# EAGLE design LCD Board v1.3 (EAGLE 6.5.0)

## Sheet 1 of 2
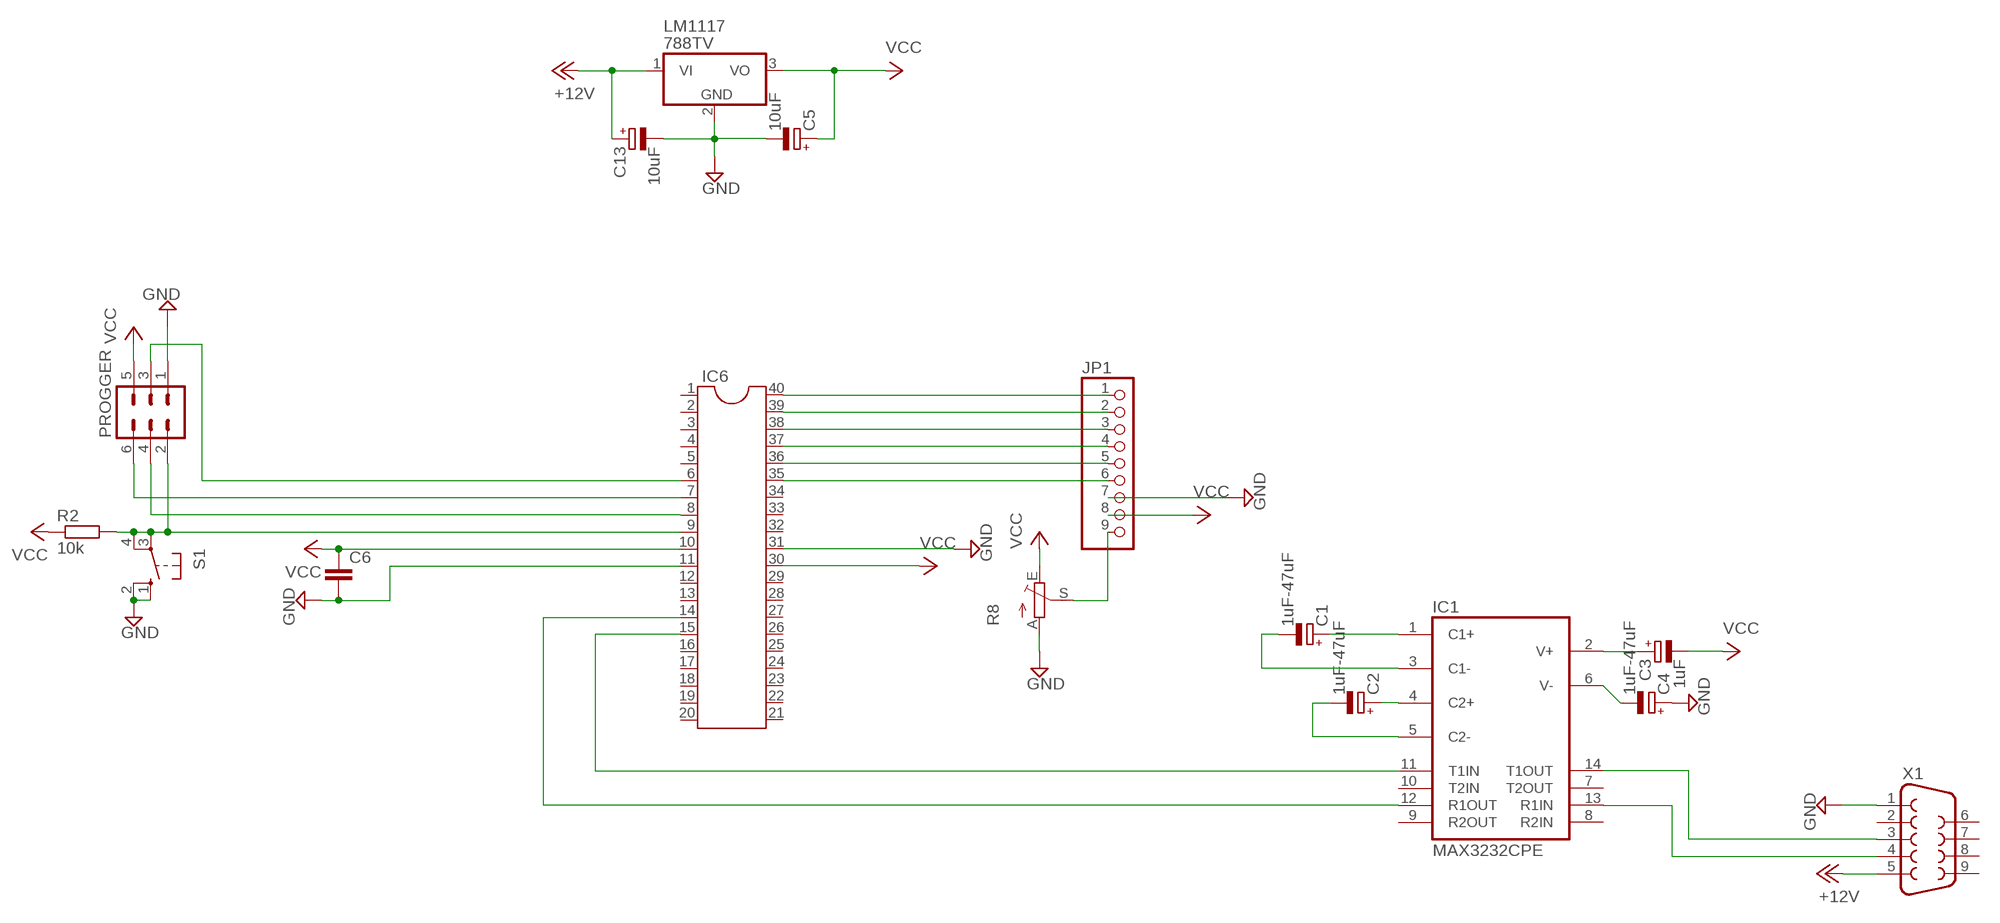
[diagram p0: schematic, sheet 1]

### Parts
C1  1uF-47uF  CPOL-EUTT5D7  [TT5D7]
C2  1uF-47uF  CPOL-EUE2.5-4V  [E2,5RE]
C3  1uF  CPOL-EUTT5D7  [TT5D7]
C4  1uF-47uF  CPOL-EUE2.5-4V  [E2,5RE]
C5  10uF  CPOL-EUE3.5-8  [E3,5-8]
C6  C-EU025-030X050  [C025-030X050]
C13  10uF  CPOL-EUE2.5-4V  [E2,5RE]
IC1  MAX3232CPE  [DIL16]
IC6  DIL40  [DIL40]
JP1  PINHD-1X9  [1X09]
LM1117  788TV  [TO220V]
PROGGER  MA03-2  [MA03-2]
R2  10k  R-EU_0207/7  [0207/7]
R8  TRIM_EU-CA6V  [CA6V]
S1  10-XX  [B3F-10XX]
X1  F09H  [F09H]

### Nets
$N4: C4.+ C5.- C6.2 C13.- IC6.11 IC6.31 JP1.7 LM1117.2(GND) PROGGER.1 R8.A S1.1(S) S1.2(S1) X1.1 ; supply symbol labelled GND ; also sheet 2
+12V: C13.+ LM1117.1(VI) X1.5 ; also sheet 2
N$1: IC6.7 PROGGER.6
N$2: IC6.8 PROGGER.4
N$3: IC6.9 PROGGER.2 R2.2 S1.3(P) S1.4(P1)
N$4: IC6.6 PROGGER.3
N$5: C1.+ IC1.1(C1+)
N$6: C1.- IC1.3(C1-)
N$7: C2.+ IC1.4(C2+)
N$8: C2.- IC1.5(C2-)
N$9: C3.+ IC1.2(V+)
N$10: C4.- IC1.6(V-)
N$11: IC1.11(T1IN) IC6.15
N$12: IC1.12(R1OUT) IC6.14
N$13: IC1.13(R1IN) X1.4
N$14: IC1.14(T1OUT) X1.3
N$15: IC6.40 JP1.1
N$16: IC6.39 JP1.2
N$17: IC6.38 JP1.3
N$18: IC6.37 JP1.4
N$19: IC6.36 JP1.5
N$20: IC6.35 JP1.6
N$21: JP1.9 R8.S
VCC: C3.- C5.+ C6.1 IC6.10 IC6.30 JP1.8 LM1117.3(VO) PROGGER.5 R2.1 R8.E ; also sheet 2
Unconnected: IC1.7(T2OUT) IC1.8(R2IN) IC1.9(R2OUT) IC1.10(T2IN) IC6.1 IC6.2 IC6.3 IC6.4 IC6.5 IC6.12 IC6.13 IC6.16 IC6.17 IC6.18 IC6.19 IC6.20 IC6.21 IC6.22 IC6.23 IC6.24 IC6.25 IC6.26 IC6.27 IC6.28 IC6.29 IC6.32 IC6.33 IC6.34 X1.2 X1.6 X1.7 X1.8 X1.9

## Sheet 2 of 2
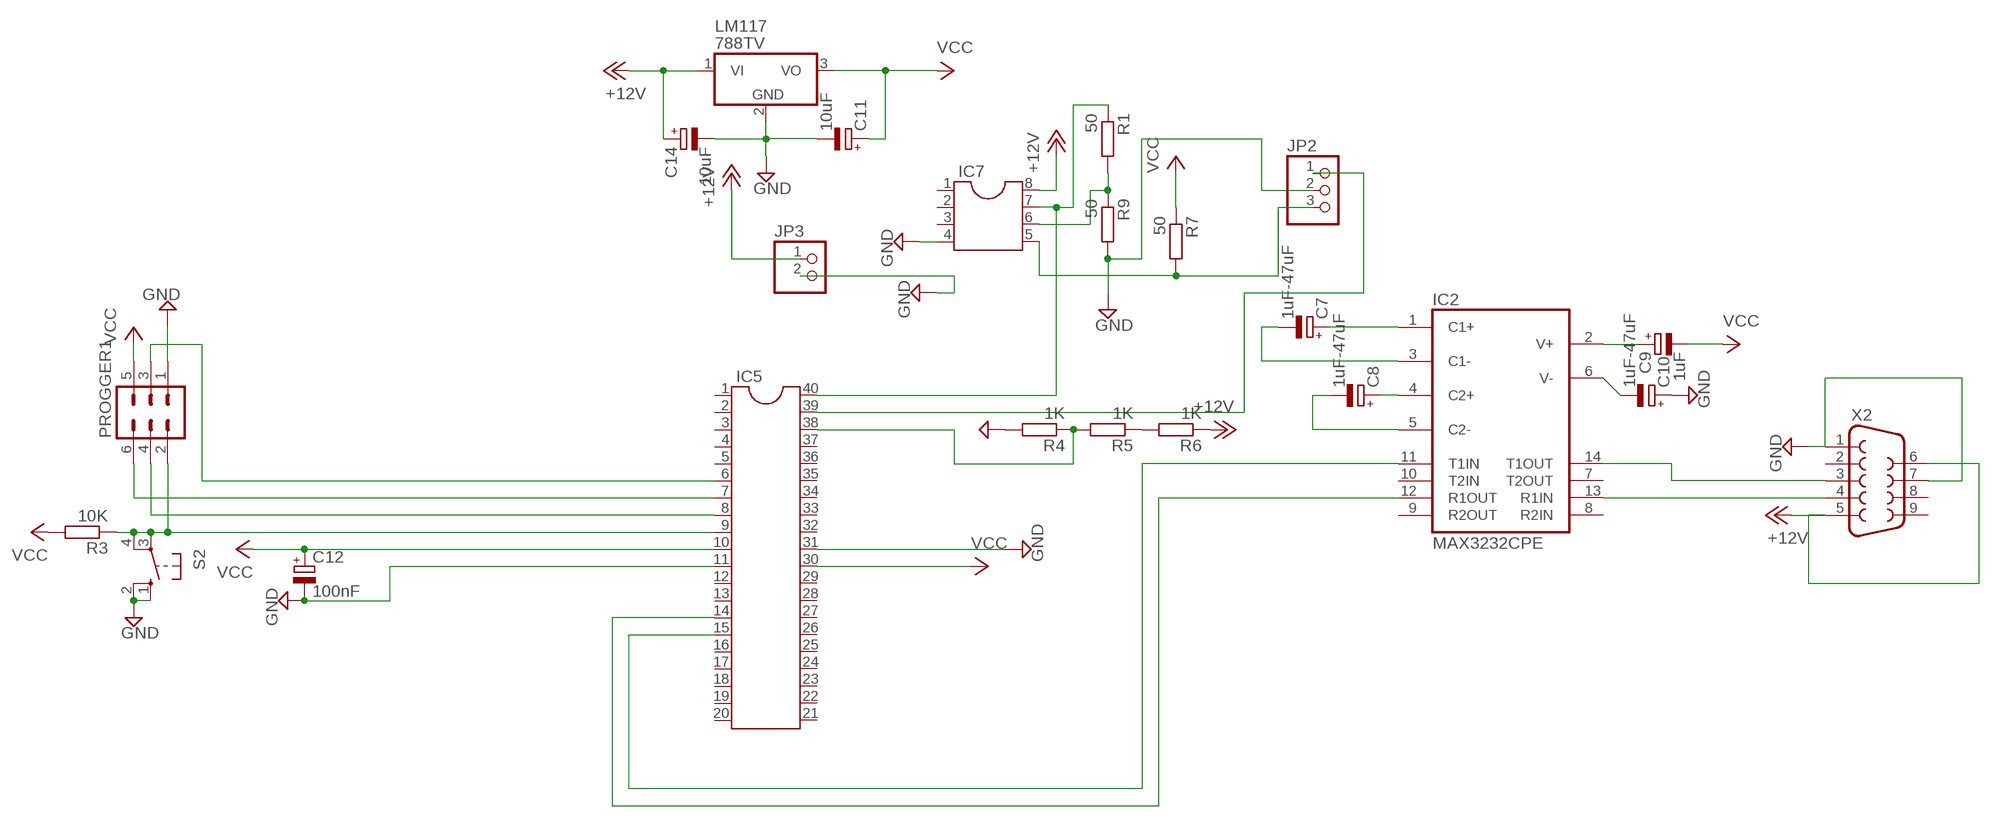
[diagram p1: schematic, sheet 2]

### Parts
C7  1uF-47uF  CPOL-EUTT5D7  [TT5D7]
C8  1uF-47uF  CPOL-EUE2.5-4V  [E2,5RE]
C9  1uF  CPOL-EUTT5D7  [TT5D7]
C10  1uF-47uF  CPOL-EUE2.5-4V  [E2,5RE]
C11  10uF  CPOL-EUE2.5-4V  [E2,5RE]
C12  100nF  CPOL-EUE2.5-4V  [E2,5RE]
C14  10uF  CPOL-EUE2.5-4V  [E2,5RE]
IC2  MAX3232CPE  [DIL16]
IC5  DIL40  [DIL40]
IC7  DIL8  [DIL08]
JP2  PINHD-1X3  [1X03]
JP3  PINHD-1X2  [1X02]
LM117  788TV  [TO220V]
PROGGER1  MA03-2  [MA03-2]
R1  50  R-EU_0204/7  [0204/7]
R3  10K  R-EU_0207/7  [0207/7]
R4  1K  R-EU_0204/7  [0204/7]
R5  1K  R-EU_0204/7  [0204/7]
R6  1K  R-EU_0204/7  [0204/7]
R7  50  R-EU_0204/5  [0204/5]
R9  50  R-EU_0204/7  [0204/7]
S2  10-XX  [B3F-10XX]
X2  F09H  [F09H]

### Nets
$N4: C10.+ C11.- C12.- C14.- IC5.11 IC5.31 IC7.4 JP2.2 JP3.2 LM117.2(GND) PROGGER1.1 R4.2 R9.2 S2.1(S) S2.2(S1) X2.1 X2.7 ; supply symbol labelled GND ; also sheet 1
+12V: C14.+ IC7.8 JP3.1 LM117.1(VI) R6.1 X2.5 X2.6 ; also sheet 1
N$22: IC5.8 PROGGER1.4
N$23: IC5.9 PROGGER1.2 R3.1 S2.3(P) S2.4(P1)
N$24: IC5.6 PROGGER1.3
N$25: C7.- IC2.3(C1-)
N$26: C8.+ IC2.4(C2+)
N$27: C8.- IC2.5(C2-)
N$28: C9.+ IC2.2(V+)
N$29: C10.- IC2.6(V-)
N$30: IC2.13(R1IN) X2.4
N$31: IC2.14(T1OUT) X2.3
N$32: IC2.11(T1IN) IC5.15
N$33: IC2.12(R1OUT) IC5.14
N$34: C7.+ IC2.1(C1+)
N$35: IC5.7 PROGGER1.6
N$36: IC5.38 R4.1 R5.2
N$37: R5.1 R6.2
N$38: IC5.40 IC7.7 R1.1
N$39: IC5.39 JP2.1
N$42: IC7.5 JP2.3 R7.2
N$44: IC7.6 R1.2 R9.1
VCC: C9.- C11.+ C12.+ IC5.10 IC5.30 LM117.3(VO) PROGGER1.5 R3.2 R7.1 ; also sheet 1
Unconnected: IC2.7(T2OUT) IC2.8(R2IN) IC2.9(R2OUT) IC2.10(T2IN) IC5.1 IC5.2 IC5.3 IC5.4 IC5.5 IC5.12 IC5.13 IC5.16 IC5.17 IC5.18 IC5.19 IC5.20 IC5.21 IC5.22 IC5.23 IC5.24 IC5.25 IC5.26 IC5.27 IC5.28 IC5.29 IC5.32 IC5.33 IC5.34 IC5.35 IC5.36 IC5.37 IC7.1 IC7.2 IC7.3 X2.2 X2.8 X2.9

## Power pins joined to a net without a drawn wire
$N4: IC1.15(GND) IC2.15(GND)
VCC: IC1.16(VCC) IC2.16(VCC)

## Library data of the parts
C1-C5 C7-C14 = rcl:CPOL-EU: POLARIZED CAPACITOR, European symbol
C6 = rcl:C-EU: CAPACITOR, European symbol
IC1 IC2 = maxim:MAX3232*: True RS-232 Transceivers 3.0V to 5.5V, Low-Power up to 1Mbps, Using Four 0.1µF External Capacitors Source: http://pdfserv.maxim-ic.com/en/ds/MAX3222-MAX3241.pdf; MF: MAXIM; MPN: MAX3232CPE+; OC_FARNELL: 9724494; OC_NEWARK: 68K4626
IC5 IC6 = ic-package:DIL40: Dual In Line
IC7 = ic-package:DIL8: Dual In Line / Socket
JP1 = pinhead:PINHD-1X9: PIN HEADER
JP2 = pinhead:PINHD-1X3: PIN HEADER
JP3 = pinhead:PINHD-1X2: PIN HEADER
LM117 LM1117 = linear:78*: Positive VOLTAGE REGULATOR Source: http://cache.national.com/ds/LM/LM78L05.pdf http://www.fairchildsemi.com/ds/LM/LM7805.pdf
PROGGER PROGGER1 = con-lstb:MA03-2: PIN HEADER; OC_FARNELL: unknown; OC_NEWARK: unknown
R1-R3 R9 = rcl:R-EU_: RESISTOR, European symbol
R4-R7 = resistor:R-EU_: RESISTOR, European symbol
R8 = pot:TRIM_EU-: POTENTIOMETER
S1 S2 = switch-omron:10-XX: OMRON SWITCH; MPN: B3F-1000; OC_FARNELL: 176432; OC_NEWARK: 36M3542
X1 X2 = con-subd:F09: SUB-D; OC_FARNELL: unknown; OC_NEWARK: unknown

## Board
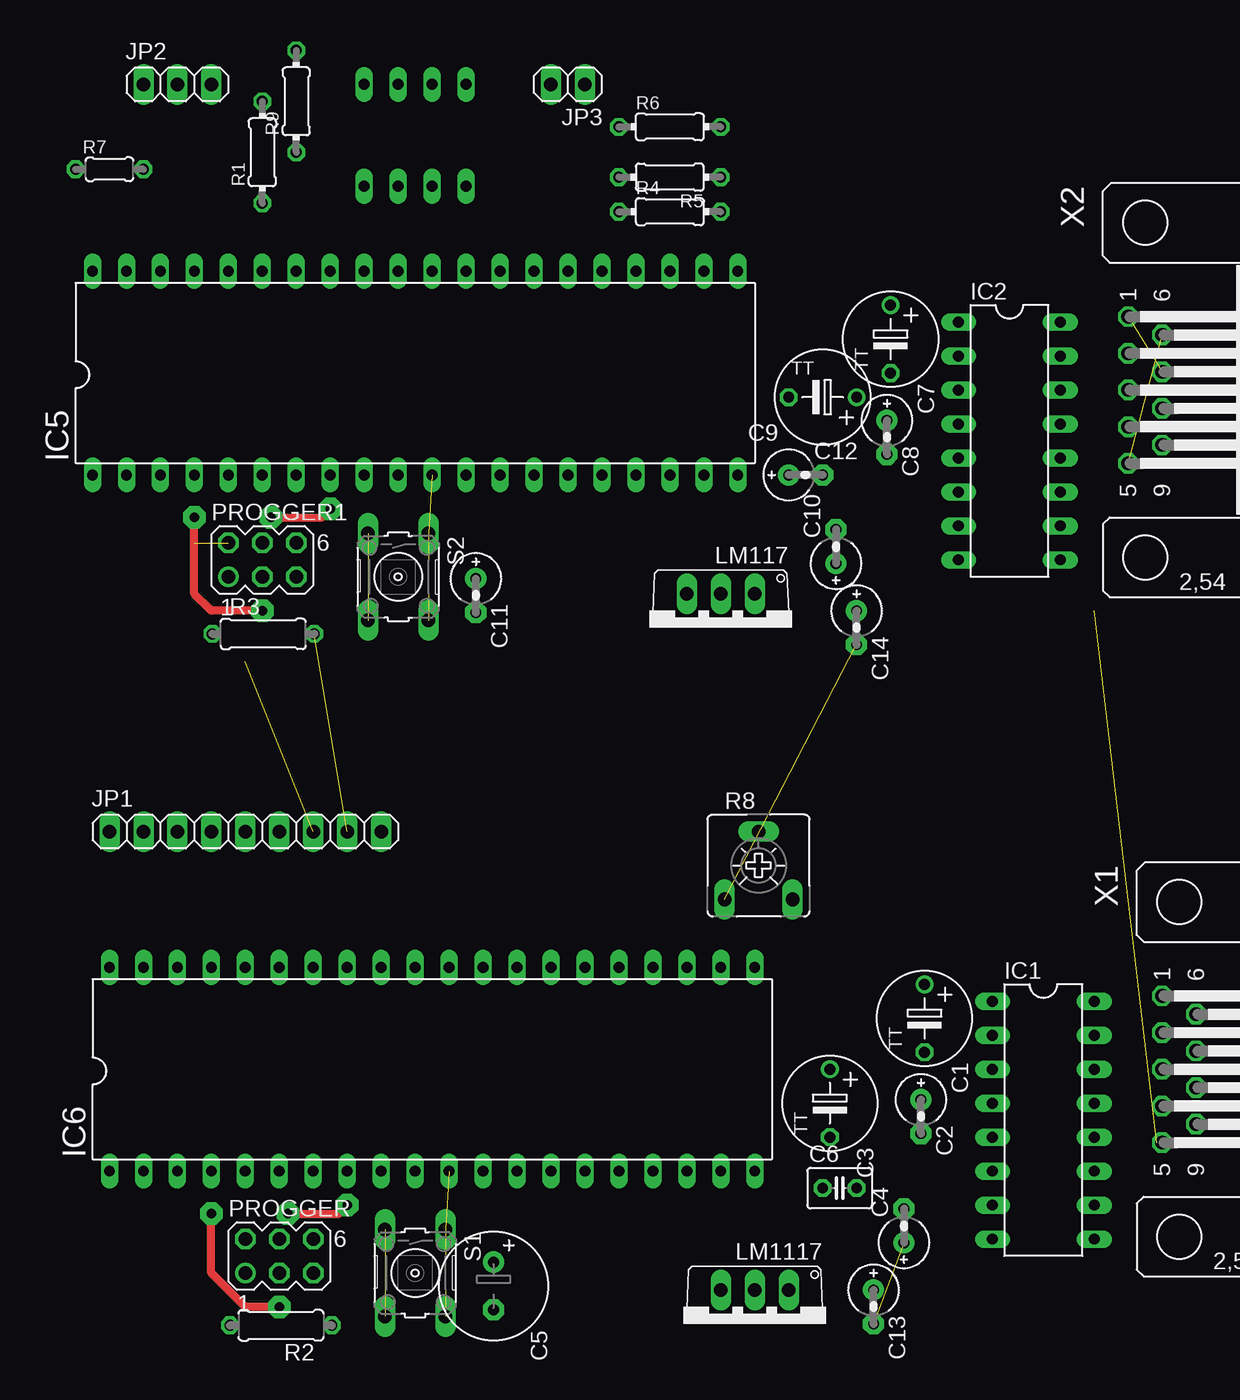
[diagram p2: board, top side]
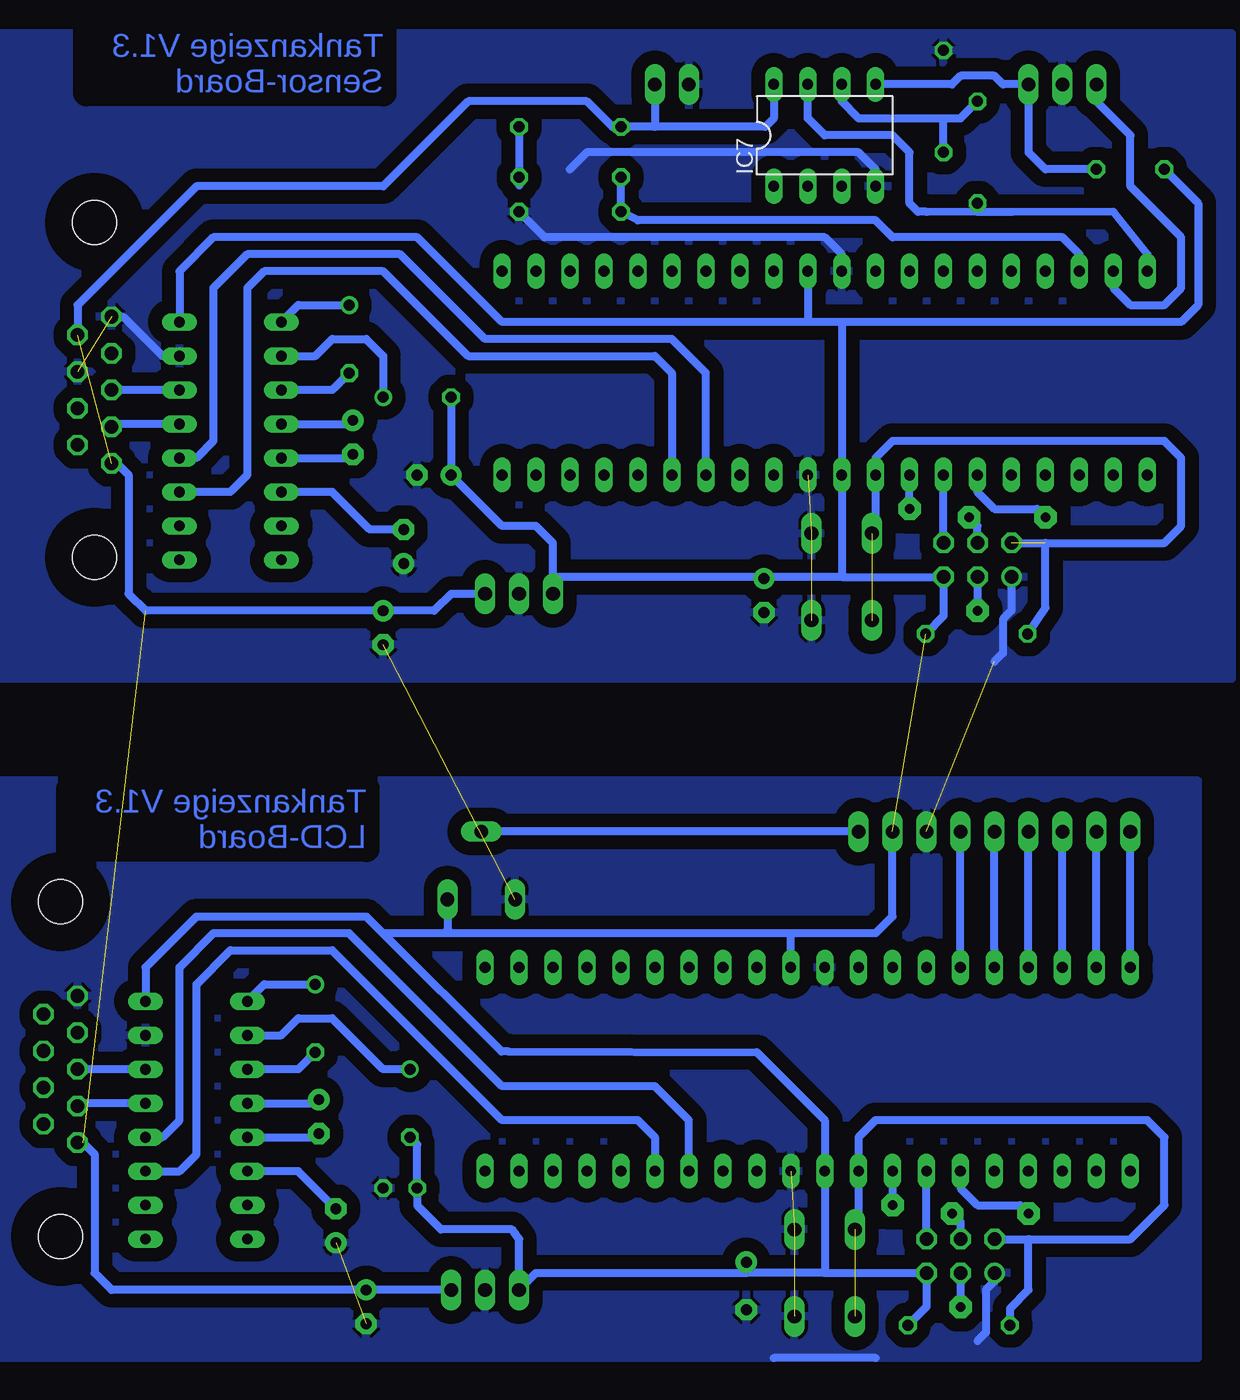
[diagram p3: board, bottom side, seen from below]

No outline drawn. Coordinates in mm, seen from the top.
Copper layers (1*16): Top 0.035mm / dielectric 1.5mm / Bottom 0.035mm
Design rules "default *": minimum track width 10mil, minimum drill 24mil, track to track 8mil, track to pad 8mil, pad to pad 8mil, via to via 8mil, smd to smd 8mil, copper to edge 40mil, drill to drill 8mil, minimum pad ring 10mil, minimum via ring 8mil, stop-mask expansion 4mil, vias tented up to drill 0mil, thermal gap 10mil

### Footprints (pad centres in the part's own frame; a part is rotated, then mirrored left to right if it is on the bottom)
TT5D7 = drill 0.813: + -2.54,0 | drill 0.813 octagon: - 2.54,0
E2,5RE = drill 0.813 pad 1.575: + -1.27,0 | drill 0.813 pad 1.575 octagon: - 1.27,0
E3,5-8 = drill 0.813 pad 1.6: + -1.778,0 | drill 0.813 pad 1.6 octagon: - 1.778,0
C025-030X050 = drill 0.813 octagon: 1 -1.27,0; 2 1.27,0
DIL16 = drill 0.813 long: 1 -8.89,-3.81; 2 -6.35,-3.81; 3 -3.81,-3.81; 4 -1.27,-3.81; 5 1.27,-3.81; 6 3.81,-3.81; 7 6.35,-3.81; 8 8.89,-3.81; 9 8.89,3.81; 10 6.35,3.81; 11 3.81,3.81; 12 1.27,3.81; 13 -1.27,3.81; 14 -3.81,3.81; 15 -6.35,3.81; 16 -8.89,3.81
DIL40 = drill 0.813 long: 1 -24.13,-7.62; 2 -21.59,-7.62; 3 -19.05,-7.62; 4 -16.51,-7.62; 5 -13.97,-7.62; 6 -11.43,-7.62; 7 -8.89,-7.62; 8 -6.35,-7.62; 9 -3.81,-7.62; 10 -1.27,-7.62; 11 1.27,-7.62; 12 3.81,-7.62; 13 6.35,-7.62; 14 8.89,-7.62; 15 11.43,-7.62; 16 13.97,-7.62; 17 16.51,-7.62; 18 19.05,-7.62; 19 21.59,-7.62; 20 24.13,-7.62; 21 24.13,7.62; 22 21.59,7.62; 23 19.05,7.62; 24 16.51,7.62; 25 13.97,7.62; 26 11.43,7.62; 27 8.89,7.62; 28 6.35,7.62; 29 3.81,7.62; 30 1.27,7.62; 31 -1.27,7.62; 32 -3.81,7.62; 33 -6.35,7.62; 34 -8.89,7.62; 35 -11.43,7.62; 36 -13.97,7.62; 37 -16.51,7.62; 38 -19.05,7.62; 39 -21.59,7.62; 40 -24.13,7.62
DIL08 = drill 0.813 long: 1 -3.81,-3.81; 2 -1.27,-3.81; 3 1.27,-3.81; 4 3.81,-3.81; 5 3.81,3.81; 6 1.27,3.81; 7 -1.27,3.81; 8 -3.81,3.81
1X09 = drill 1.016 long: 1 -10.16,0; 2 -7.62,0; 3 -5.08,0; 4 -2.54,0; 5 0,0; 6 2.54,0; 7 5.08,0; 8 7.62,0; 9 10.16,0
1X03 = drill 1.016 long: 1 -2.54,0; 2 0,0; 3 2.54,0
1X02 = drill 1.016 long: 1 -1.27,0; 2 1.27,0
TO220V = drill 1.016 long: 1 -2.54,-2.54; 2 0,-2.54; 3 2.54,-2.54
MA03-2 = drill 1.016: 1 -2.54,-1.27 | drill 1.016 octagon: 2 -2.54,1.27; 3 0,-1.27; 4 0,1.27; 5 2.54,-1.27; 6 2.54,1.27
0204/7 = drill 0.813 octagon: 1 -3.81,0; 2 3.81,0
0207/7 = drill 0.813 octagon: 1 -3.81,0; 2 3.81,0
0204/5 = drill 0.813 octagon: 1 -2.54,0; 2 2.54,0
CA6V = drill 1.016 long: A -2.54,-2.54; E 2.54,-2.54; S 0,2.54
B3F-10XX = drill 1.016 long: 1 -3.251,2.261; 2 3.251,2.261; 3 -3.251,-2.261; 4 3.251,-2.261
F09H = drill 1.016 octagon: 1 -5.486,-1.27; 2 -2.743,-1.27; 3 0,-1.27; 4 2.743,-1.27; 5 5.486,-1.27; 6 -4.115,1.27; 7 -1.372,1.27; 8 1.372,1.27; 9 4.115,1.27 | hole 3.302: -12.522,0; 12.522,0

### Placement (x,y rotation side)
C1  77.47,26.67 270 top
C2  77.2,19.32 270 top
C3  70.39,20.32 270 top
C4  75.93,11.16 90 top
C5  45.23,6.65 270 top
C6  71.12,13.97 0 top
C7  74.93,77.47 270 top
C8  74.66,70.12 270 top
C9  69.85,73.12 180 top
C10  70.85,61.96 90 top
C11  43.91,58.28 270 top
C12  68.58,67.31 0 top
C13  73.66,5.08 270 top
C14  72.39,55.88 270 top
IC1  86.36,19.05 270 top
IC2  83.82,69.85 270 top
IC5  39.37,74.93 0 top
IC6  40.64,22.86 0 top
IC7  39.37,92.71 0 bottom
JP1  26.67,40.64 0 top
JP2  21.59,96.52 0 top
JP3  50.8,96.52 180 top
LM117  62.23,55.88 180 top
LM1117  64.77,3.81 180 top
PROGGER  29.21,8.89 0 top
PROGGER1  27.94,60.96 0 top
R1  27.94,91.44 90 top
R2  29.33,3.71 180 top
R3  28.01,55.42 0 top
R4  58.42,87 0 top
R5  58.41,89.58 180 top
R6  58.42,93.34 0 top
R7  16.51,90.17 0 top
R8  65.05,38.1 0 top
R9  30.48,95.25 90 top
S1  39.37,7.62 270 top
S2  38.1,59.69 270 top
X1  96.52,22.86 270 top
X2  93.98,73.66 270 top

### Tracks (layer width: path | path; a pad name or v marks a point on that pad's centre or on a via)
$N4  (8 unrouted)
  Bottom 0.61: IC7.4 35.56,90.17 36.83,91.44 57.15,91.44 58.42,90.17 | X2.1 91.85,79.15 88.9,76.2 IC2.15 | IC5.31 38.1,83.82 39.37,85.09 60.33,85.09 R4.2 | PROGGER.1 26.67,6.99 27.3,6.35 27.3,3.17 27.94,2.54 | 35.56,1.27 43.18,1.27 | PROGGER1.1 25.4,57.15 26.04,56.52 26.04,53.98 26.67,53.34
  pour Bottom (isolate 1.016): 106.68,1.27 11.43,1.27 11.43,44.45 106.68,44.45
  pour Bottom (isolate 1.016): 104.14,52.07 8.89,52.07 8.89,100.33 104.14,100.33
+12V  (2 unrouted)
  Bottom 0.61: LM117.1 67.31,58.42 68.58,57.15 C14.+ 90.17,57.15 91.44,58.42 91.44,67.31 92.3,68.17 X2.5 | IC7.8 43.18,93.98 43.81,93.34 52.07,93.34 | 52.07,93.34 R6.1 55.24,93.34 57.15,95.25 66.04,95.25 72.39,88.9 86.36,88.9 95.25,80.01 X2.6 | JP3.1 52.07,93.34 | LM1117.1 C13.+ 92.71,6.35 93.98,7.62 93.98,16.51 94.84,17.37 X1.5
N$1
  Bottom 0.61: PROGGER.6 IC6.7
N$2  (via drill 0.7 pad 1.68)
  Top 0.61: v29.84,12.06 33.66,12.06 v34.29,12.7
  Bottom 0.61: IC6.8 v34.29,12.7 | v29.84,12.06 29.21,11.43 PROGGER.4
N$3  (1 unrouted)
  Bottom 0.61: PROGGER.2 24.13,10.16 | 24.13,10.16 16.51,10.16 13.97,12.7 13.97,17.78 15.24,19.05 35.56,19.05 36.83,17.78 IC6.9 | 36.83,16.51 IC6.9 | R2.2 25.5,4.98 24.13,6.35 24.13,10.16 | IC6.9 36.83,11.15 S1.3
N$4  (via drill 0.7 pad 1.68)
  Top 0.61: v29.21,5.08 26.67,5.08 24.13,7.62 v24.13,12.06
  Bottom 0.61: PROGGER.3 v29.21,5.08 | IC6.6 29.21,13.97 27.94,12.7 24.77,12.7 v24.13,12.06
N$5
  Bottom 0.61: IC1.1 81.28,29.21 C1.+
N$6
  Bottom 0.61: C1.- 78.74,22.86 IC1.3
N$7
  Bottom 0.61: IC1.4 77.22,20.32 C2.+
N$8
  Bottom 0.61: IC1.5 77.72,17.78 C2.-
N$9
  Bottom 0.61: IC1.2 80.01,25.4 78.74,26.67 76.2,26.67 72.39,22.86 C3.+
N$10
  Bottom 0.61: C4.- 75.68,12.18 78.74,15.24 IC1.6
N$11
  Bottom 0.61: IC6.15 52.07,17.78 53.34,19.05 63.5,19.05 76.2,31.75 83.82,31.75 86.36,29.21 86.36,16.51 87.63,15.24 IC1.11
N$12
  Bottom 0.61: IC1.12 88.9,17.78 87.63,19.05 87.63,30.48 85.09,33.02 74.93,33.02 63.5,21.59 52.07,21.59 49.53,19.05 IC6.14
N$13
  Bottom 0.61: IC1.13 95.05,20.32 X1.4
N$14
  Bottom 0.61: IC1.14 X1.3
N$15
  Bottom 0.61: IC6.40 JP1.1
N$16
  Bottom 0.61: IC6.39 JP1.2
N$17
  Bottom 0.61: IC6.38 JP1.3
N$18
  Bottom 0.61: IC6.37 JP1.4
N$19
  Bottom 0.61: 26.67,31.75 IC6.36 JP1.5
N$20
  Bottom 0.61: IC6.35 JP1.6
N$21
  Bottom 0.61: JP1.9 R8.S
N$22  (via drill 0.7 pad 1.68)
  Top 0.61: v28.57,64.14 32.38,64.14 v33.02,64.77
  Bottom 0.61: PROGGER1.4 27.94,63.5 v28.57,64.14 | v33.02,64.77 IC5.8
N$23  (2 unrouted)
  Bottom 0.61: S2.3 35.56,63.22 IC5.9 35.56,68.58 34.29,69.85 13.97,69.85 12.7,68.58 12.7,63.5 13.97,62.23 PROGGER1.2 | 22.86,62.23 22.86,57.39 R3.1
N$24  (via drill 0.7 pad 1.68)
  Top 0.61: v27.94,57.15 24.13,57.15 22.86,58.42 v22.86,64.14
  Bottom 0.61: IC5.6 27.94,66.04 26.67,64.77 23.5,64.77 v22.86,64.14 | PROGGER1.3 v27.94,57.15
N$25
  Bottom 0.61: C7.- 76.2,73.66 IC2.3
N$26
  Bottom 0.61: IC2.4 74.68,71.12 C8.+
N$27
  Bottom 0.61: IC2.5 75.18,68.58 C8.-
N$28
  Bottom 0.61: IC2.2 77.47,76.2 76.2,77.47 73.66,77.47 72.39,76.2 C9.+
N$29
  Bottom 0.61: IC2.6 76.2,66.04 73.39,63.23 C10.-
N$30
  Bottom 0.61: IC2.13 92.51,71.12 X2.4
N$31
  Bottom 0.61: IC2.14 X2.3
N$32
  Bottom 0.61: IC2.11 83.82,66.04 82.55,67.31 82.55,81.28 81.28,82.55 72.39,82.55 66.04,76.2 52.07,76.2 50.8,74.93 IC5.15
N$33
  Bottom 0.61: IC5.14 48.26,74.93 50.8,77.47 64.77,77.47 71.12,83.82 82.55,83.82 85.09,81.28 85.09,69.85 86.36,68.58 IC2.12
N$34
  Bottom 0.61: IC2.1 78.74,80.01 C7.+
N$35
  Bottom 0.61: PROGGER1.6 IC5.7
N$36
  Bottom 0.61: IC5.38 20.32,83.82 21.59,85.09 34.29,85.09 35.56,86.36 53.34,86.36 R4.1 54.61,88.94 R5.2
N$37
  Bottom 0.61: R6.2 62.23,88.95 R5.1
N$38
  Bottom 0.61: IC5.40 15.24,83.82 17.78,87 25.4,86.97 27.94,86.98 | 27.94,86.98 31.75,87 32.38,87 33.02,87.63 33.02,91.44 34.29,92.71 39.37,92.71 40.64,93.98 IC7.7 | R1.1 27.94,86.98
N$39
  Bottom 0.61: IC5.39 17.78,81.28 16.51,80.01 13.97,80.01 12.7,81.28 12.7,85.09 16.51,88.9 16.51,92.71 19.05,95.25 JP2.1
N$42
  Bottom 0.61: R7.2 22.86,90.17 24.13,91.44 JP2.3 26.04,96.52 26.67,97.16 29.21,97.16 29.84,96.52 IC7.5
N$44
  Bottom 0.61: IC7.6 38.1,95.25 36.83,93.98 30.48,93.98 | 30.48,93.98 29.21,93.98 R1.2 | R9.1 30.48,93.98
VCC  (1 unrouted)
  Bottom 0.61: C9.- C12.+ 63.5,63.5 60.96,63.5 59.69,62.23 59.69,59.69 | 41.91,33.02 35.56,33.02 34.29,34.29 JP1.8 | 41.91,33.02 67.31,33.02 | R8.E 67.59,33.3 67.31,33.02 | LM117.3 59.69,59.69 | IC5.30 40.64,78.74 | 38.1,78.74 IC5.10 38.1,59.69 | R7.1 11.43,87.63 11.43,80.01 12.7,78.74 38.1,78.74 | 38.1,78.74 40.64,78.74 | 72.39,33.02 63.55,24.18 63,24.18 44.45,24.13 39.37,19.05 IC6.10 39.37,7.62 | 67.31,33.02 72.39,33.02 | 40.64,78.74 63.5,78.74 69.85,85.09 85.09,85.09 87.63,82.55 IC2.16 | 39.37,7.62 45.19,7.62 C5.+ 45.28,7.62 60.96,7.62 LM1117.3 62.23,10.16 62.77,10.88 68.07,10.88 69.85,12.66 C6.1 69.85,17.24 C3.- | 43.52,59.69 C11.+ | 43.52,59.69 59.69,59.69 | 38.1,59.69 43.52,59.69 | 39.37,7.62 PROGGER.5 31.75,5.1 R2.1 | 38.1,59.69 PROGGER1.5 30.48,56.76 R3.2 | 72.39,33.02 73.66,34.29 86.36,34.29 90.17,30.48 IC1.16 | IC6.30 41.91,33.02

### Text on the board
Bottom: Tankanzeige V1.3 / Sensor-Board | Tankanzeige V1.3 / LCD-Board